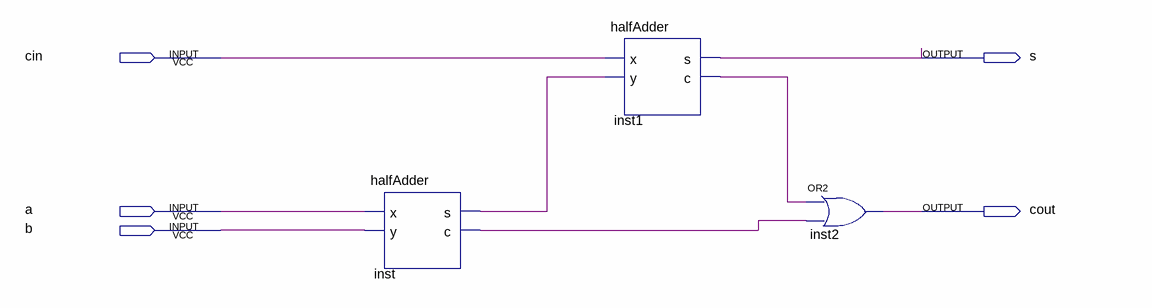
[diagram p0: schematic sheet]
// Quartus schematic fullAdder.bdf as structural Verilog: 3 symbols, 5 pins
module fullAdder (
  input  cin,
  input  a,
  input  b,
  output s,
  output cout
);

  wire inst1_c, inst_c, inst_s;

  halfAdder inst (.x(a), .y(b), .s(inst_s), .c(inst_c));
  halfAdder inst1 (.x(cin), .y(inst_s), .s(s), .c(inst1_c));
  or inst2 (cout, inst1_c, inst_c);
endmodule
